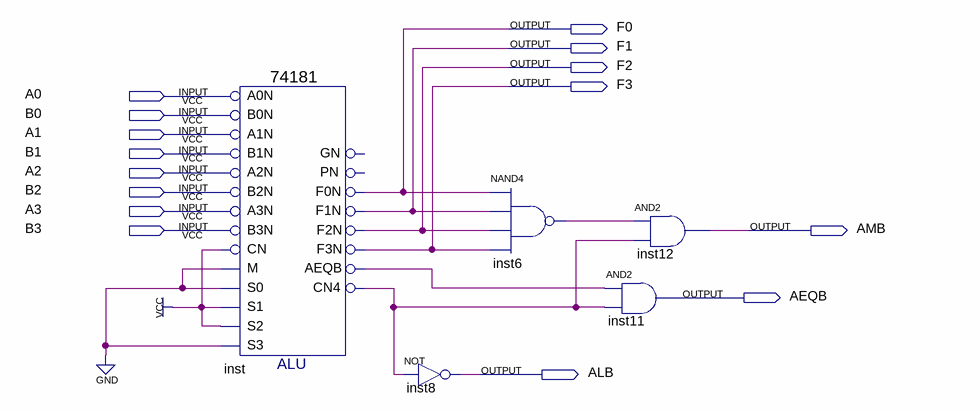
[diagram p0: schematic sheet]
// Quartus schematic 74181_cmp.bdf as structural Verilog: 5 symbols, 15 pins
module \74181_cmp  (
  input  A0,
  input  B0,
  input  A1,
  input  B1,
  input  A2,
  input  B2,
  input  A3,
  input  B3,
  output F0,
  output F1,
  output F2,
  output F3,
  output AMB,
  output AEQB,
  output ALB
);

  wire inst6_out, inst_aeqb, inst_cn4;

  \74181  inst (
    .B0N(B0), .A0N(A0), .A1N(A1), .B1N(B1), .A3N(A3), .B2N(B2), .A2N(A2), .M(1'b0), .CN(1'b1), .B3N(B3),
    .S2(1'b1), .S1(1'b1), .S0(1'b0), .S3(1'b0), .F3N(F3), .F1N(F1), .F0N(F0), .AEQB(inst_aeqb),
    .CN4(inst_cn4), .F2N(F2));  // open: PN, GN
  not inst8 (ALB, inst_cn4);
  nand inst6 (inst6_out, F0, F1, F2, F3);
  and inst11 (AEQB, inst_aeqb, inst_cn4);
  and inst12 (AMB, inst6_out, inst_cn4);
endmodule
